# Altium schematic sheet main.SchDoc
size A4
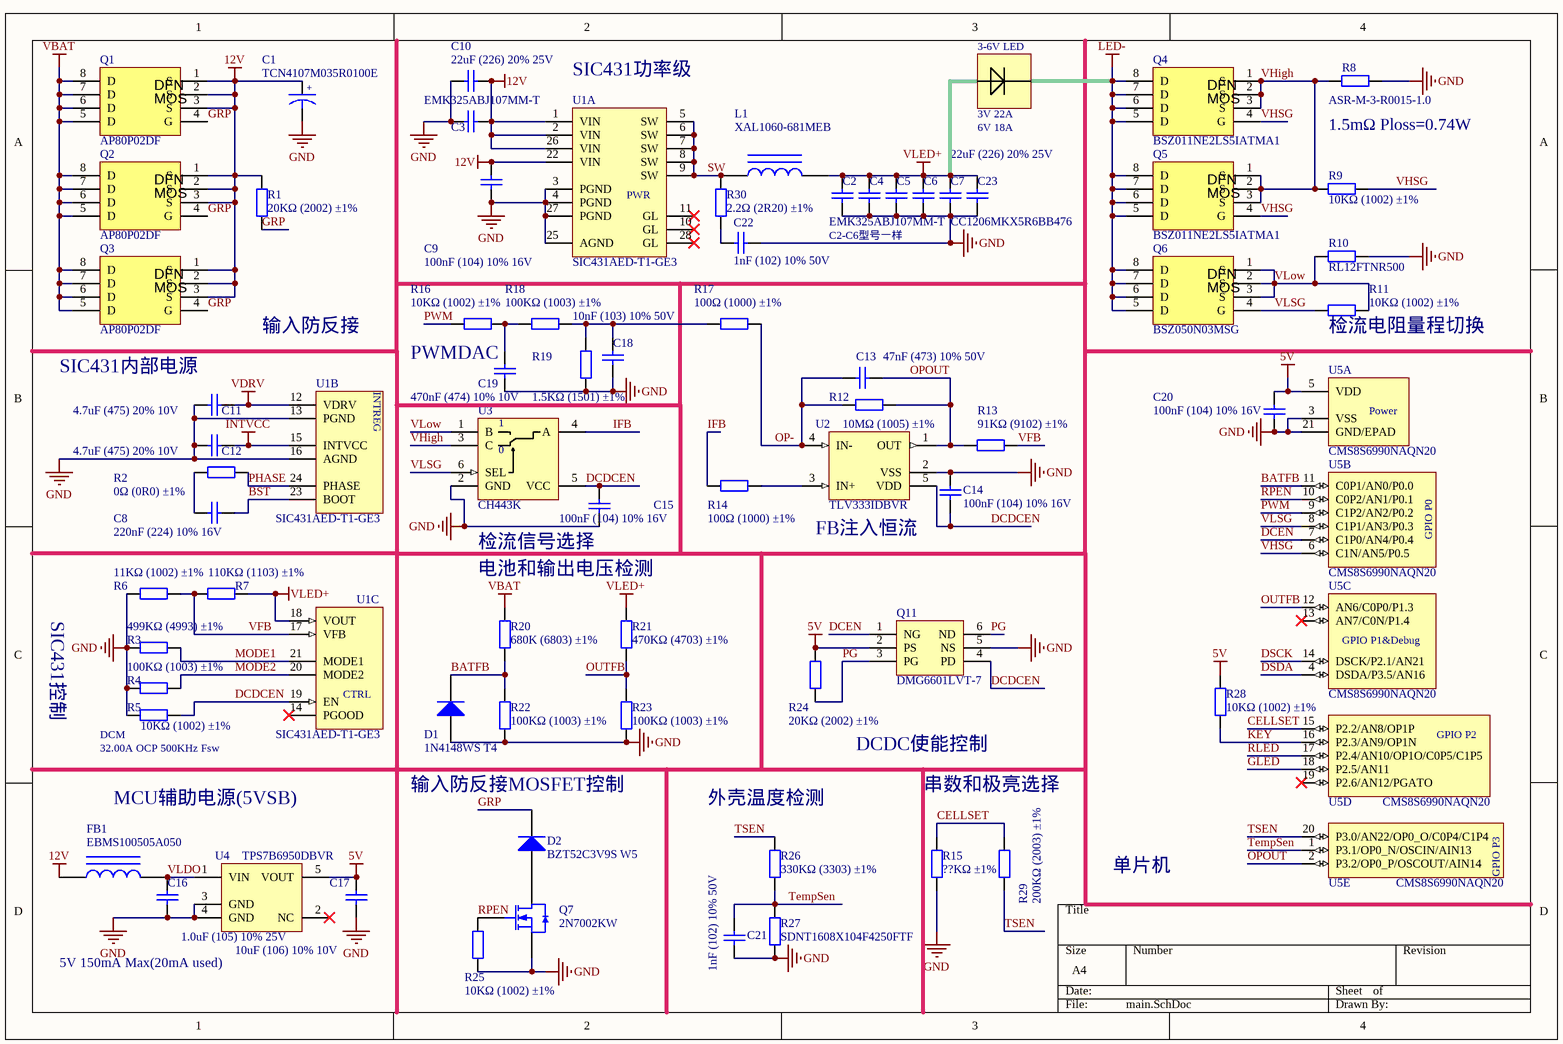
[diagram p0: main.SchDoc]

## Parts
C1  TCN4107M035R0100E  [TCN4]
C2  EMK325ABJ107MM-T  [1210C]
C3  EMK325ABJ107MM-T  [1210C]
C4  EMK325ABJ107MM-T  [1210C]  (value not drawn)
C5  EMK325ABJ107MM-T  [1210C]  (value not drawn)
C6  EMK325ABJ107MM-T  [1210C]  (value not drawn)
C7  22uF (226) 20% 25V  [0805_C]
C8  220nF (224) 10% 16V  [0402_C]
C9  100nF (104) 10% 16V  [0402_C]
C10  22uF (226) 20% 25V  [0805_C]
C11  4.7uF (475) 20% 10V  [0402_C]
C12  4.7uF (475) 20% 10V  [0402_C]
C13  47nF (473) 10% 50V  [0402_C]
C14  100nF (104) 10% 16V  [0402_C]
C15  100nF (104) 10% 16V  [0402_C]
C16  1.0uF (105) 10% 25V  [0402_C]
C17  10uF (106) 10% 10V  [0603_C]
C18  10nF (103) 10% 50V  [0402_C]
C19  470nF (474) 10% 10V  [0402_C]
C20  100nF (104) 10% 16V  [0402_C]
C21  1nF (102) 10% 50V  [0402_C]
C22  1nF (102) 10% 50V  [0402_C]
C23  CC1206MKX5R6BB476  [1206C]
D1  1N4148WS T4  [SOD-323]
D2  BZT52C3V9S W5  [SOD-323]
FB1  EBMS100505A050  [0402_L]
L1  XAL1060-681MEB  [XAL1010-XXXME]
Q1  AP80P02DF  [DFN-8_L3.0-W3.0-P0.65-BL]
Q2  AP80P02DF  [DFN-8_L3.0-W3.0-P0.65-BL]
Q3  AP80P02DF  [DFN-8_L3.0-W3.0-P0.65-BL]
Q4  BSZ011NE2LS5IATMA1  [DFN-8_L3.0-W3.0-P0.65-BL]
Q5  BSZ011NE2LS5IATMA1  [DFN-8_L3.0-W3.0-P0.65-BL]
Q6  BSZ050N03MSG  [DFN-8_L3.0-W3.0-P0.65-BL]
Q7  2N7002KW  [SC70-3]
Q11  DMG6601LVT-7  [SOT95P245X110-6N]
R1  20KΩ (2002) ±1%  [0402_R]
R2  0Ω (0R0) ±1%  [0402_R]
R3  499KΩ (4993) ±1%  [0402_R]
R4  100KΩ (1003) ±1%  [0402_R]
R5  10KΩ (1002) ±1%  [0402_R]
R6  11KΩ (1002) ±1%  [0402_R]
R7  110KΩ (1103) ±1%  [0402_R]
R8  ASR-M-3-R0015-1.0  [2512]
R9  10KΩ (1002) ±1%  [0402_R]
R10  RL12FTNR500  [1206R]
R11  10KΩ (1002) ±1%  [0402_R]
R12  10MΩ (1005) ±1%  [0402_R]
R13  91KΩ (9102) ±1%  [0402_R]
R14  100Ω (1000) ±1%  [0402_R]
R15  ??KΩ ±1%  [0603_R]
R16  10KΩ (1002) ±1%  [0402_R]
R17  100Ω (1000) ±1%  [0402_R]
R18  100KΩ (1003) ±1%  [0402_R]
R19  1.5KΩ (1501) ±1%  [0402_R]
R20  680K (6803) ±1%  [0402_R]
R21  470KΩ (4703) ±1%  [0402_R]
R22  100KΩ (1003) ±1%  [0402_R]
R23  100KΩ (1003) ±1%  [0402_R]
R24  20KΩ (2002) ±1%  [0402_R]
R25  10KΩ (1002) ±1%  [0402_R]
R26  330KΩ (3303) ±1%  [0402_R]
R27  SDNT1608X104F4250FTF  [0603_R]
R28  10KΩ (1002) ±1%  [0402_R]
R29  200KΩ (2003) ±1%  [0402_R]
R30  2.2Ω (2R20) ±1%  [0805_R]
U1  SIC431AED-T1-GE3  [QFN_ED-T1-GE3_VIS]  (parts A,B,C of 3)
U2  TLV333IDBVR  [SOT95P245X110-5N]
U3  CH443K  [SC70-6]
U4  TPS7B6950DBVR  [SOT95P245X110-5N]
U5  CMS8S6990NAQN20  [QFN40P300X300X800_HS-21N]  (parts A,B,C,D,E of 5)

## Nets
5V: C17.2 C20.2 Q11.2(PS) R24.2 R28.2 U4.5(VOUT) U5.5(VDD)
12V: C1.1 C3.2 C9.2 C10.2 FB1.1 Q1.1(S) Q1.2(S) Q1.3(S) Q2.1(S) Q2.2(S) Q2.3(S) Q3.1(S) Q3.2(S) Q3.3(S) R1.2 U1.1(VIN) U1.2(VIN) U1.22(VIN) U1.26(VIN)
GND: C1.2 C2.1 C3.1 C4.1 C5.1 C6.1 C7.1 C9.1 C10.1 C11.1 C12.1 C14.2 C15.1 C16.1 C17.1 C18.1 C19.1 C20.1 C21.1 C22.1 C23.1 D1.1(A) Q7.2(S) Q11.5(NS) R3.1 R4.1 R5.1 R6.2 R8.1 R10.1 R15.1 R19.1 R22.1 R23.1 R25.1 R27.2 U1.3(PGND) U1.4(PGND) U1.13(PGND) U1.16(AGND) U1.25(AGND) U1.27(PGND) U2.2(VSS) U3.2(GND) U4.3(GND) U4.4(GND) U5.3(VSS) U5.21(GND/EPAD)
INTVCC: C12.2 U1.15(INTVCC)
LED-: Q4.5(D) Q4.6(D) Q4.7(D) Q4.8(D) Q5.5(D) Q5.6(D) Q5.7(D) Q5.8(D) Q6.5(D) Q6.6(D) Q6.7(D) Q6.8(D)
VBAT: Q1.5(D) Q1.6(D) Q1.7(D) Q1.8(D) Q2.5(D) Q2.6(D) Q2.7(D) Q2.8(D) Q3.5(D) Q3.6(D) Q3.7(D) Q3.8(D) R20.2
VDRV: C11.2 U1.12(VDRV)
VLED+: C2.2 C4.2 C5.2 C6.2 C7.2 C23.2 L1.2 R7.1 R21.2 U1.18(VOUT)
BATFB: D1.2(K) R20.1 R22.2 U5.11(C0P1/AN0/P0.0)
BST: C8.2 U1.23(BOOT)
CELLSET: R15.2 R29.2 U5.15(P2.2/AN8/OP1P)
DCDCEN: C14.1 C15.2 Q11.4(PD) R5.2 U1.19(EN) U2.5(VDD) U3.5(VCC)
DCEN: Q11.1(NG) U5.7(C1P0/AN4/P0.4)
DSCK: U5.14(DSCK/P2.1/AN21)
DSDA: U5.4(DSDA/P3.5/AN16)
GLED: U5.18(P2.5/AN11)
GRP: D2.2(K) Q1.4(G) Q2.4(G) Q3.4(G) R1.1
IFB: R14.1 U3.4(A)
KEY: R28.1 U5.16(P2.3/AN9/OP1N)
MODE1: R3.2 U1.21(MODE1)
MODE2: R4.2 U1.20(MODE2)
OP-: C13.1 R12.1 R17.2 U2.4(IN-)
OPOUT: C13.2 R12.2 R13.1 U2.1(OUT) U5.2(P3.2/OP0_P/OSCOUT/AIN14)
OUTFB: R21.1 R23.2 U5.12(AN6/C0P0/P1.3)
PG: Q11.3(PG) Q11.6(ND) R24.1
PHASE: R2.2 U1.24(PHASE)
PWM: R16.1 U5.9(C1P2/AN2/P0.2)
RLED: U5.17(P2.4/AN10/OP1O/C0P5/C1P5)
RPEN: Q7.1(G) R25.2 U5.10(C0P2/AN1/P0.1)
SW: L1.1 R30.2 U1.5(SW) U1.6(SW) U1.7(SW) U1.8(SW) U1.9(SW)
TempSen: C21.2 R26.1 R27.1 U5.1(P3.1/OP0_N/OSCIN/AIN13)
TSEN: R26.2 R29.1 U5.20(P3.0/AN22/OP0_O/C0P4/C1P4)
VFB: R6.1 R7.2 R13.2 U1.17(VFB)
VHigh: Q4.1(S) Q4.2(S) Q4.3(S) Q5.1(S) Q5.2(S) Q5.3(S) R8.2 R9.1 U3.3(C)
VHSG: Q4.4(G) Q5.4(G) R9.2 U5.6(C1N/AN5/P0.5)
VLDO: C16.2 FB1.2 U4.1(VIN)
VLow: Q6.1(S) Q6.2(S) Q6.3(S) R10.2 R11.2 U3.1(B)
VLSG: Q6.4(G) R11.1 U3.6(SEL) U5.8(C1P1/AN3/P0.3)
NetC8_1: C8.1 R2.1
NetC18_2: C18.2 R17.1 R18.2 R19.2
NetC19_2: C19.2 R16.2 R18.1
NetC22_2: C22.2 R30.1
NetD2_1: D2.1(A) Q7.3(D)
NetR14_2: R14.2 U2.3(IN+)

Not connected (* = marked no-connect by the designer): U1 10(GL)* 11(GL)* 14(PGOOD)* 28(GL)*; U4 2(NC)*; U5 13(AN7/C0N/P1.4)* 19(P2.6/AN12/PGATO)*

## Notes on the sheet
- 3-6V LED
- (near U1) SIC431功率级
- 3V 22A
- 6V 18A
- 1.5mΩ Ploss=0.74W
- C2-C6型号一样
- SIC431内部电源
- 输入防反接
- (near R16) PWMDAC
- (near R11) 检流电阻量程切换
- 电池和输出电压检测
- 检流信号选择
- (near U2) FB注入恒流
- SIC431控制
- (near R5) 32.00A OCP 500KHz Fsw
- (near R5) DCM
- 输入防反接MOSFET控制
- DCDC使能控制
- 串数和极亮选择
- MCU辅助电源(5VSB)
- (near R26) 外壳温度检测
- 单片机
- 5V 150mA Max(20mA used)
- (in symbol CAP2) +
- (in symbol CM8S6990NA-QFN20, part A) Power
- (in symbol CM8S6990NA-QFN20, part B) GPIO P0
- (in symbol CM8S6990NA-QFN20, part C) GPIO P1&Debug
- (in symbol CM8S6990NA-QFN20, part D) GPIO P2
- (in symbol CM8S6990NA-QFN20, part E) GPIO P3
- (in symbol NC7SB3157P6X) 0
- (in symbol SIC431AED-T1-GE3, part A) PWR
- (in symbol SIC431AED-T1-GE3, part B) INTREG
- (in symbol SIC431AED-T1-GE3, part C) CTRL
- (in symbol SON/DFN5x6 MOS) DFN; MOS

## Library data of the parts
C1 = CAP2: 京瓷/AVX 贴片聚合物钽电容器 35V 100uF ±20% 2924 ESR=100mΩ
C2-C6 = Cap: 1210尺寸多层陶瓷电容器(MLCC) X5R材质，16V 100uF±20%; Value: 100uF; Published: 8-Jun-2000; LatestRevisionDate: 17-Jul-2002; LatestRevisionNote: Re-released for DXP Platform.; PackageReference: RAD-0.3; Publisher: Altium Limited; PackageDescription: Radial Cap, Thru-Hole; 2 Leads; 0.3 in Pin Spacing
C7 C10 = 0805 22uF (226) 20% 25V: 贴片电容; ComponentLink1Description: 供应商链接; ComponentLink1URL: http://www.szlcsc.com/product/details_46786.html; Package: 0805; Supplier: LC; SuppliersPartNumber: C45783
C8 = 0402 220nF (224) 10% 16V: 贴片电容; ComponentLink1Description: 供应商链接; ComponentLink1URL: http://www.szlcsc.com/product/details_17456.html; Package: 0402; Supplier: LC; SuppliersPartNumber: C16772
C9 C13-C15 C20 = 0402 100nF (104) 10% 16V: 贴片电容; ComponentLink1Description: 供应商链接; ComponentLink1URL: http://www.szlcsc.com/product/details_1877.html; Package: 0402; Supplier: LC; SuppliersPartNumber: C1525
C11 C12 = 0402 4.7uF (475) 20% 10V: 贴片电容; ComponentLink1Description: 供应商链接; ComponentLink1URL: http://www.szlcsc.com/product/details_24469.html; Package: 0402; Supplier: LC; SuppliersPartNumber: C23733
C16 = 0402 1.0uF (105) 10% 25V: 贴片电容; ComponentLink1Description: 供应商链接; ComponentLink1URL: http://www.szlcsc.com/product/details_53938.html; Package: 0402; Supplier: LC; SuppliersPartNumber: C52923
C17 = 0603 10uF (106) 10% 10V: 贴片电容; ComponentLink1Description: 供应商链接; ComponentLink1URL: http://www.szlcsc.com/product/details_20411.html; Package: 0603; Supplier: LC; SuppliersPartNumber: C19702
C18 = 0402 10nF (103) 10% 50V: 贴片电容; ComponentLink1Description: 供应商链接; ComponentLink1URL: http://www.szlcsc.com/product/details_15869.html; Package: 0402; Supplier: LC; SuppliersPartNumber: C15195
C19 = 0402 470nF (474) 10% 10V: 贴片电容; ComponentLink1Description: 供应商链接; ComponentLink1URL: http://www.szlcsc.com/product/details_48344.html; Package: 0402; Supplier: LC; SuppliersPartNumber: C47339
C21 C22 = 0402 1nF (102) 10% 50V: 贴片电容; ComponentLink1Description: 供应商链接; ComponentLink1URL: http://www.szlcsc.com/product/details_1875.html; Package: 0402; Supplier: LC; SuppliersPartNumber: C1523
C23 = Cap: 1206 MLCC电容 10V 47uF±20% X5R; Value: 47uF 10V; Published: 8-Jun-2000; LatestRevisionDate: 17-Jul-2002; LatestRevisionNote: Re-released for DXP Platform.; PackageReference: RAD-0.3; Publisher: Altium Limited; PackageDescription: Radial Cap, Thru-Hole; 2 Leads; 0.3 in Pin Spacing
D1 = SOD-323 1N4148WS T4: 二极管; ComponentLink1Description: 供应商链接; ComponentLink1URL: http://www.szlcsc.com/product/details_2485.html; Package: SOD-323; Supplier: LC; SuppliersPartNumber: C2128
D2 = SOD-323 1N4148WS T4: SOD-323封装贴片稳压二极管，3.9V 200mW; ComponentLink1Description: 供应商链接; ComponentLink1URL: http://www.szlcsc.com/product/details_2485.html; Package: SOD-323; Supplier: LC; SuppliersPartNumber: C2128
FB1 = 0402 12nH  5%: 贴片磁珠 200mA 5R±25% 100MHz; ComponentLink1Description: 供应商链接; ComponentLink1URL: http://www.szlcsc.com/product/details_25303.html; Package: 0402; Supplier: LC; SuppliersPartNumber: C24563
L1 = Inductor Iron: Coilcraft Inductor XAL1070 Series; Value: 0.22uH; Published: 24-Mar-1999; LatestRevisionDate: 17-Jul-2002; LatestRevisionNote: Re-released for DXP Platform.; PackageReference: AXIAL-0.9; Publisher: Altium Limited; PackageDescription: Axial Device, Thru-Hole; 2 Leads; 0.9 in Pin Spacing
Q1-Q3 = SON/DFN5x6 MOS: 永源微 PDFN3x3-8L -20V -80A 4.0mΩ P沟道MOSFET; DataSheetLink: http://www.apm-mos.com/uploadfiles/2023/09/AP80P02DF%20%20-80A%20%20-20V%20%20PDFN3X3-8L.pdf
Q4 Q5 = SON/DFN5x6 MOS: PDFN3x3 37nC 25V 40A 1.1mΩ OptiMOS-5 N沟道MOSFET
Q6 = SON/DFN5x6 MOS: PDFN3x3 30V 45A 4.6mΩ OptiMOS-3 N沟道MOSFET
Q7 = 2N7002 7002: 单N沟道MOSFET(场效应管); ComponentLink1Description: 供应商链接; ComponentLink1URL: http://www.szlcsc.com/product/details_9040.html; Package: SOT-323; Supplier: LC; SuppliersPartNumber: C???????
Q11 = DMG6601LVT: SOT23-6 N+P Ch. MOSFET
R1 R24 = 0402 20KΩ (2002) 1%: 贴片电阻; ComponentLink1Description: 供应商链接; ComponentLink1URL: http://www.szlcsc.com/product/details_26508.html; Package: 0402; Supplier: LC; SuppliersPartNumber: C25765
R2 = 0402 0Ω (0R0) 1%: 贴片电阻; ComponentLink1Description: 供应商链接; ComponentLink1URL: http://www.szlcsc.com/product/details_17853.html; Package: 0402; Supplier: LC; SuppliersPartNumber: C17168
R3 R4 R13 R18 R22 R23 R29 = 0402 100KΩ (1003) 1%: 贴片电阻; ComponentLink1Description: 供应商链接; ComponentLink1URL: http://www.szlcsc.com/product/details_26484.html; Package: 0402; Supplier: LC; SuppliersPartNumber: C25741
R5-R7 R9 R11 R16 R25 R28 = 0402 10KΩ (1002) 1%: 贴片电阻; ComponentLink1Description: 供应商链接; ComponentLink1URL: http://www.szlcsc.com/product/details_26487.html; Package: 0402; Supplier: LC; SuppliersPartNumber: C25744
R8 = Res: 深圳华讯高科精密检流电阻，2512 1.5mΩ±1% 卡玛材质 <50ppm/K P70℃=3W; Value: R003; Published: 8-Jun-2000; LatestRevisionDate: 17-Jul-2002; LatestRevisionNote: Re-released for DXP Platform.; PackageReference: AXIAL-0.4; Publisher: Altium Limited; PackageDescription: Axial Device, Thru-Hole; 2 Leads; 0.4 in Pin Spacing
R10 = Res: 1206厚膜采样电阻 0.5Ω ±1% 1/2W; Value: 1R0; Published: 8-Jun-2000; LatestRevisionDate: 17-Jul-2002; LatestRevisionNote: Re-released for DXP Platform.; PackageReference: AXIAL-0.4; Publisher: Altium Limited; PackageDescription: Axial Device, Thru-Hole; 2 Leads; 0.4 in Pin Spacing
R12 = 0402 1MΩ (1004) 1%: 贴片电阻; ComponentLink1Description: 供应商链接; ComponentLink1URL: http://www.szlcsc.com/product/details_26826.html; Package: 0402; Supplier: LC; SuppliersPartNumber: C26083
R14 R17 = 0402 470Ω (4700) 1%: 贴片电阻; ComponentLink1Description: 供应商链接; ComponentLink1URL: http://www.szlcsc.com/product/details_25860.html; Package: 0402; Supplier: LC; SuppliersPartNumber: C25117
R15 = 0603 10KΩ (1002) 1%: 贴片电阻; ComponentLink1Description: 供应商链接; ComponentLink1URL: http://www.szlcsc.com/product/details_26547.html; Package: 0603; Supplier: LC; SuppliersPartNumber: C25804
R19 = 0402 1.5KΩ (1501) 1%: 贴片电阻; ComponentLink1Description: 供应商链接; ComponentLink1URL: http://www.szlcsc.com/product/details_26610.html; Package: 0402; Supplier: LC; SuppliersPartNumber: C25867
R20 = 0402 680Ω (6800) 1%: 贴片电阻; ComponentLink1Description: 供应商链接; ComponentLink1URL: http://www.szlcsc.com/product/details_25873.html; Package: 0402; Supplier: LC; SuppliersPartNumber: C25130
R21 = 0402 470KΩ (4703) 1%: 贴片电阻; ComponentLink1Description: 供应商链接; ComponentLink1URL: http://www.szlcsc.com/product/details_26533.html; Package: 0402; Supplier: LC; SuppliersPartNumber: C25790
R26 = 0402 330KΩ (3303) 1%: 贴片电阻; ComponentLink1Description: 供应商链接; ComponentLink1URL: http://www.szlcsc.com/product/details_26521.html; Package: 0402; Supplier: LC; SuppliersPartNumber: C25778
R27 = 0603 100KΩ (1003) 1%: 0603贴片NTC热敏电阻，100KΩ (1003) ±1% B4250; ComponentLink1Description: 供应商链接; ComponentLink1URL: http://www.szlcsc.com/product/details_26546.html; Package: 0603; Supplier: LC; SuppliersPartNumber: C95955
R30 = 0805 1Ω (1R00) 1%: 贴片电阻; ComponentLink1Description: 供应商链接; ComponentLink1URL: http://www.szlcsc.com/product/details_26014.html; Package: 0805; Supplier: LC; SuppliersPartNumber: C25271
U1 = SIC431AED-T1-GE3: 3 to 24V Input 24A MicroBuck DCDC Converter with bulit-in MOSFET
U2 = TLV333IDBVR: 低噪声轨到轨输入输出精密运放 350Khz
U3 = NC7SB3157P6X: Low-Voltage Analog Switch SPDT,1.8-5V Power
U4 = TPS7B6933DBVR: 150mA 40V max input Ultra low Iq LDO,fixed 5V output
U5 = CM8S6990NA-QFN20: 增强型闪存1T 8051单片机，16KB Flash 256+1K XRAM